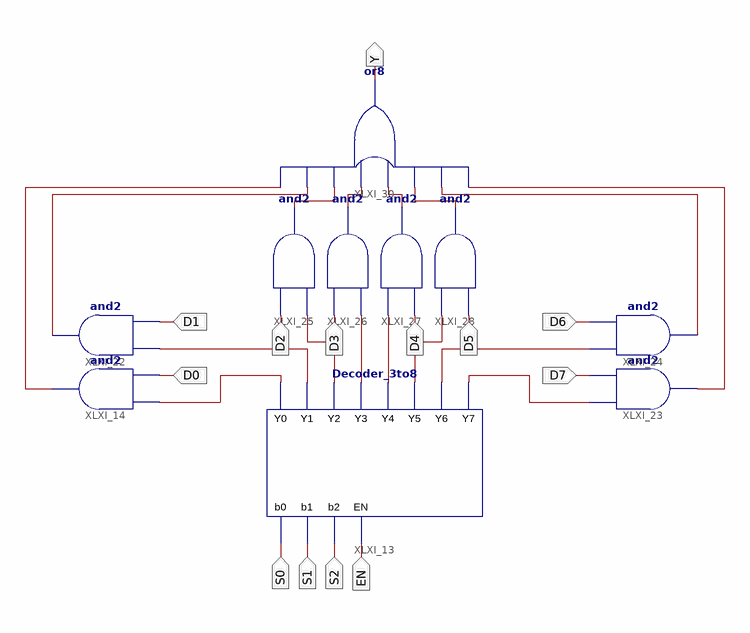
[diagram p0: schematic sheet 1]
// Xilinx ISE schematic MUX_8to1.sch (spartan3e) as structural Verilog: 10 symbols, 13 ports
module MUX_8to1 (
  input  D2,
  input  D3,
  input  D4,
  input  D5,
  input  D1,
  input  D0,
  input  D6,
  input  D7,
  input  S0,
  input  S1,
  input  S2,
  input  EN,
  output Y
);

  wire XLXN_109, XLXN_110, XLXN_113, XLXN_118, XLXN_119, XLXN_120, XLXN_121, XLXN_122, XLXN_162, XLXN_163,
       XLXN_164, XLXN_165, XLXN_166, XLXN_167, XLXN_168, XLXN_169;

  Decoder_3to8 XLXI_13 (
    .b0(S0), .b1(S1), .b2(S2), .EN(EN), .Y0(XLXN_109), .Y1(XLXN_110), .Y2(XLXN_119), .Y3(XLXN_120),
    .Y4(XLXN_121), .Y5(XLXN_122), .Y6(XLXN_118), .Y7(XLXN_113));
  and XLXI_14 (XLXN_162, D0, XLXN_109);
  and XLXI_22 (XLXN_163, D1, XLXN_110);
  and XLXI_23 (XLXN_168, XLXN_113, D7);
  and XLXI_24 (XLXN_169, XLXN_118, D6);
  and XLXI_25 (XLXN_164, XLXN_119, D2);
  and XLXI_26 (XLXN_165, XLXN_120, D3);
  and XLXI_27 (XLXN_166, D4, XLXN_121);
  and XLXI_28 (XLXN_167, D5, XLXN_122);
  or XLXI_30 (Y, XLXN_168, XLXN_169, XLXN_167, XLXN_166, XLXN_165, XLXN_164, XLXN_163, XLXN_162);
endmodule
